# Altium project iMX6 Rex_V1I1.PrjPcb (part 4 of 5)

## Sheet [15] - PWR 3V3, 1V375.SchDoc
size A2; DocumentNumber: 15; SheetNumber: 15; SheetTotal: 20
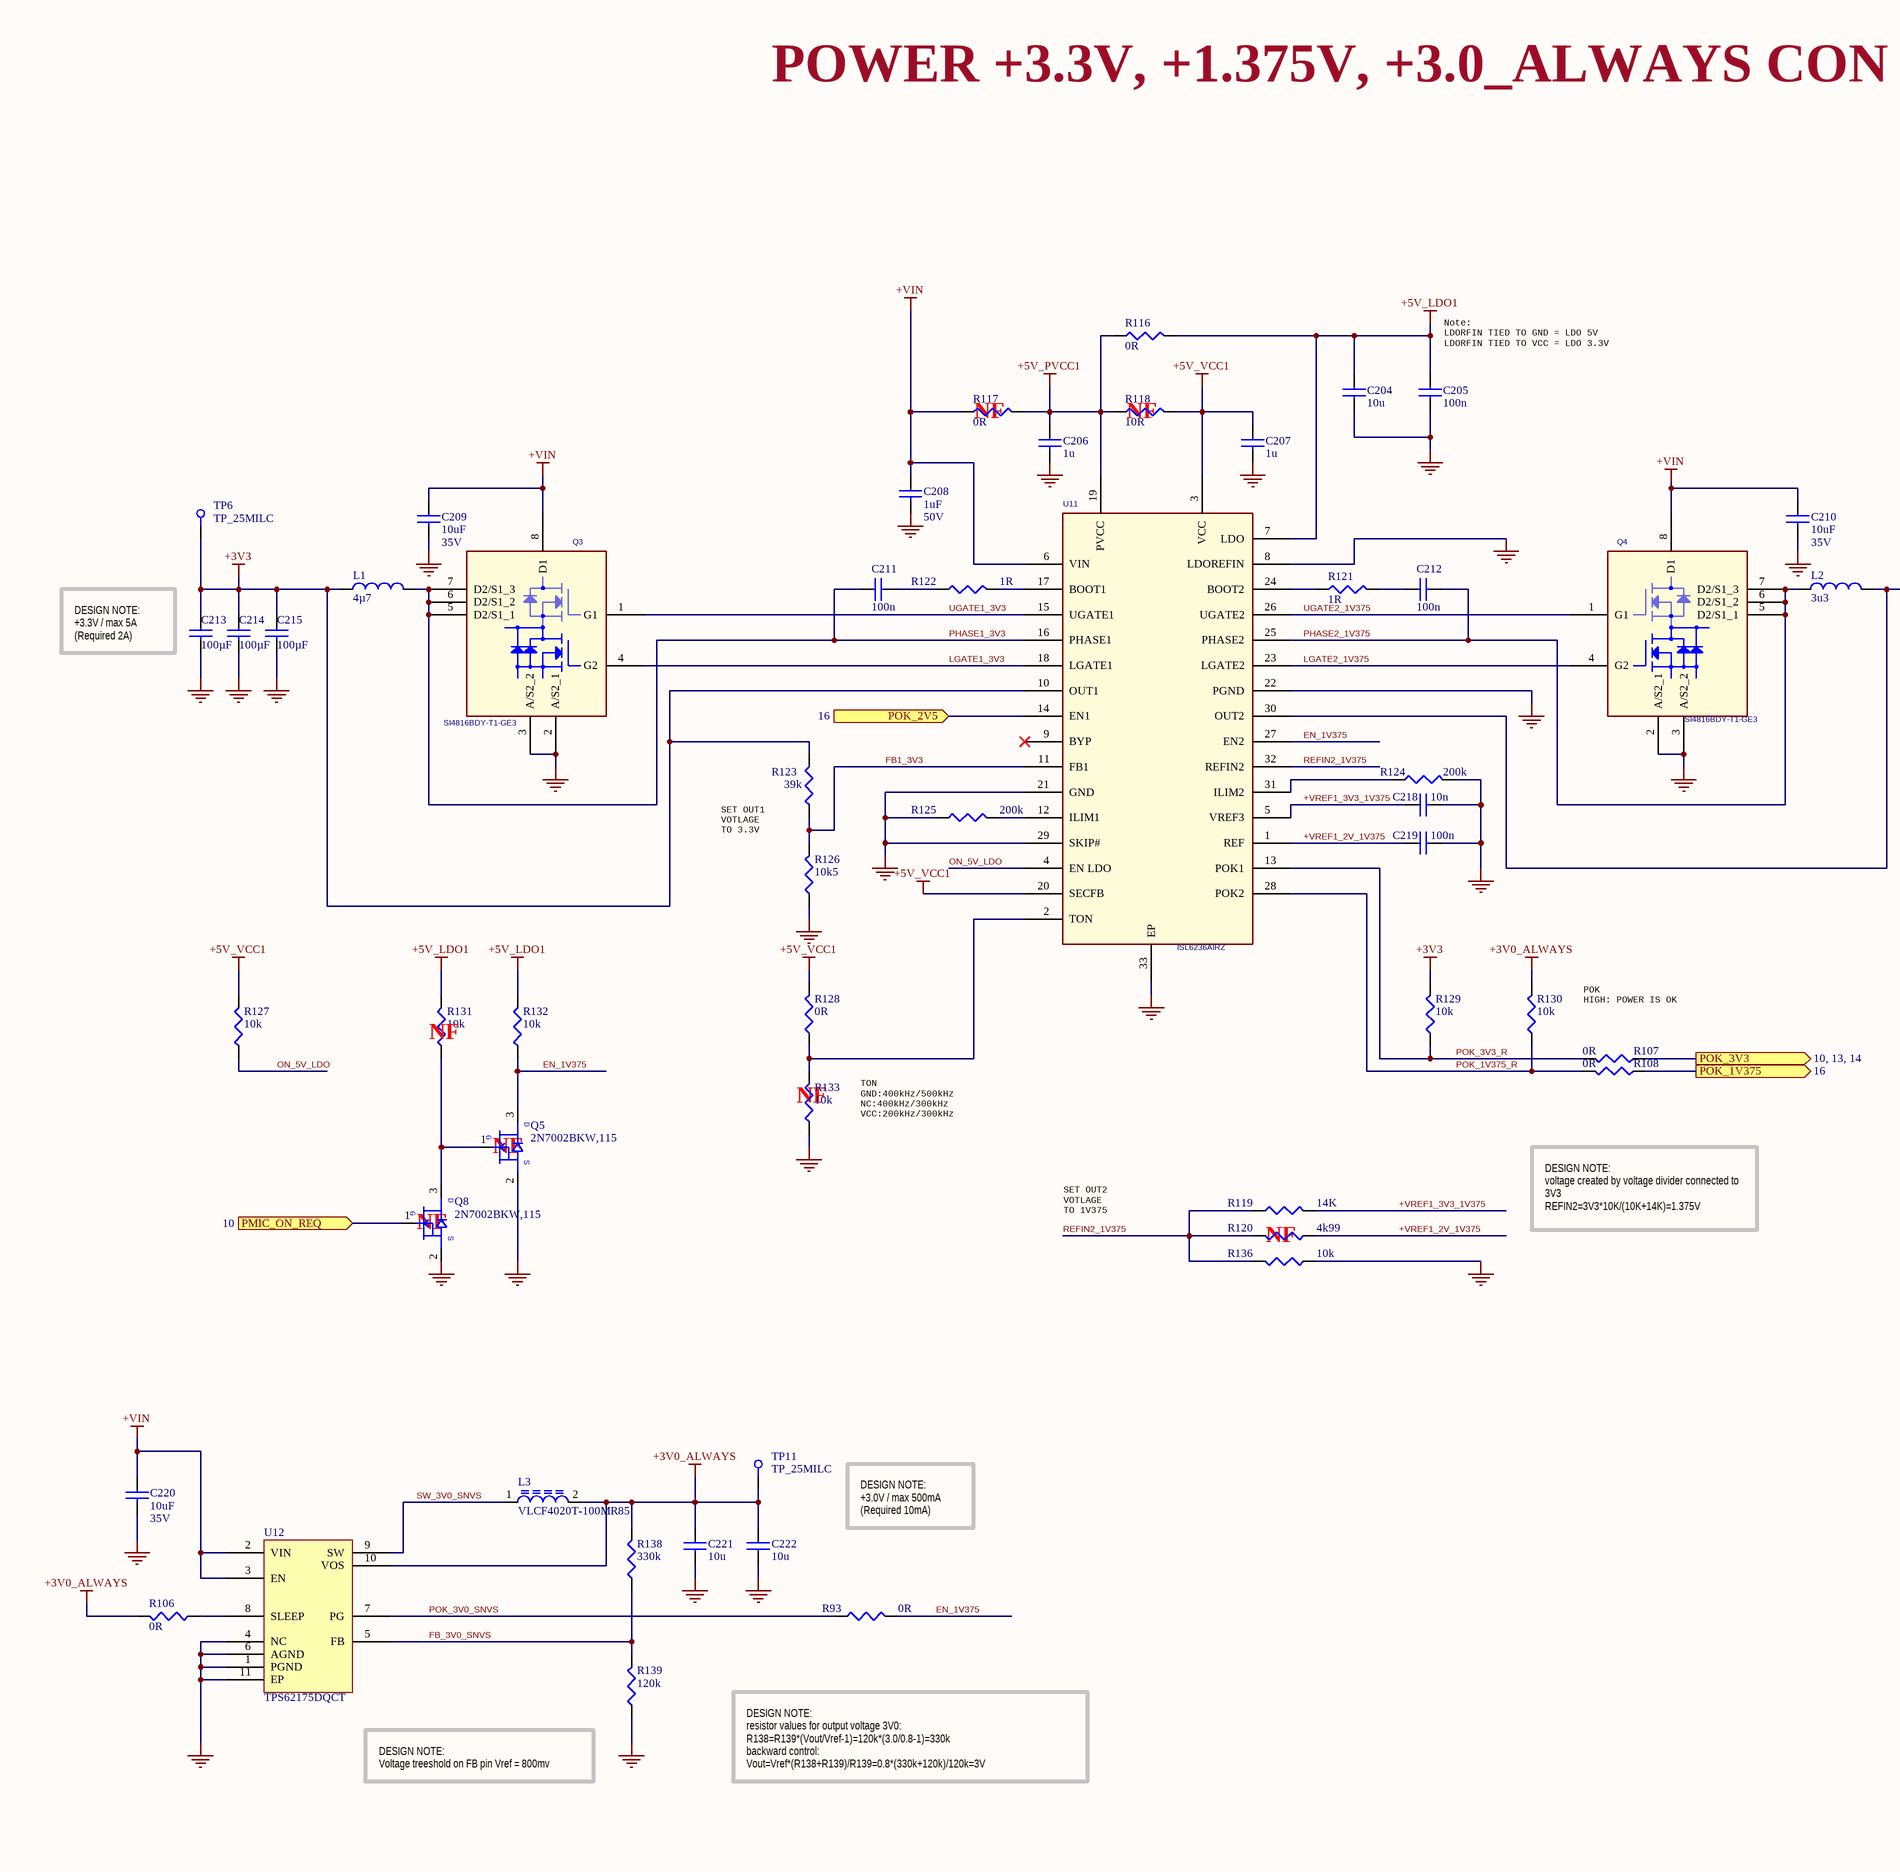
[diagram p16: [15] - PWR 3V3, 1V375.SchDoc, left]
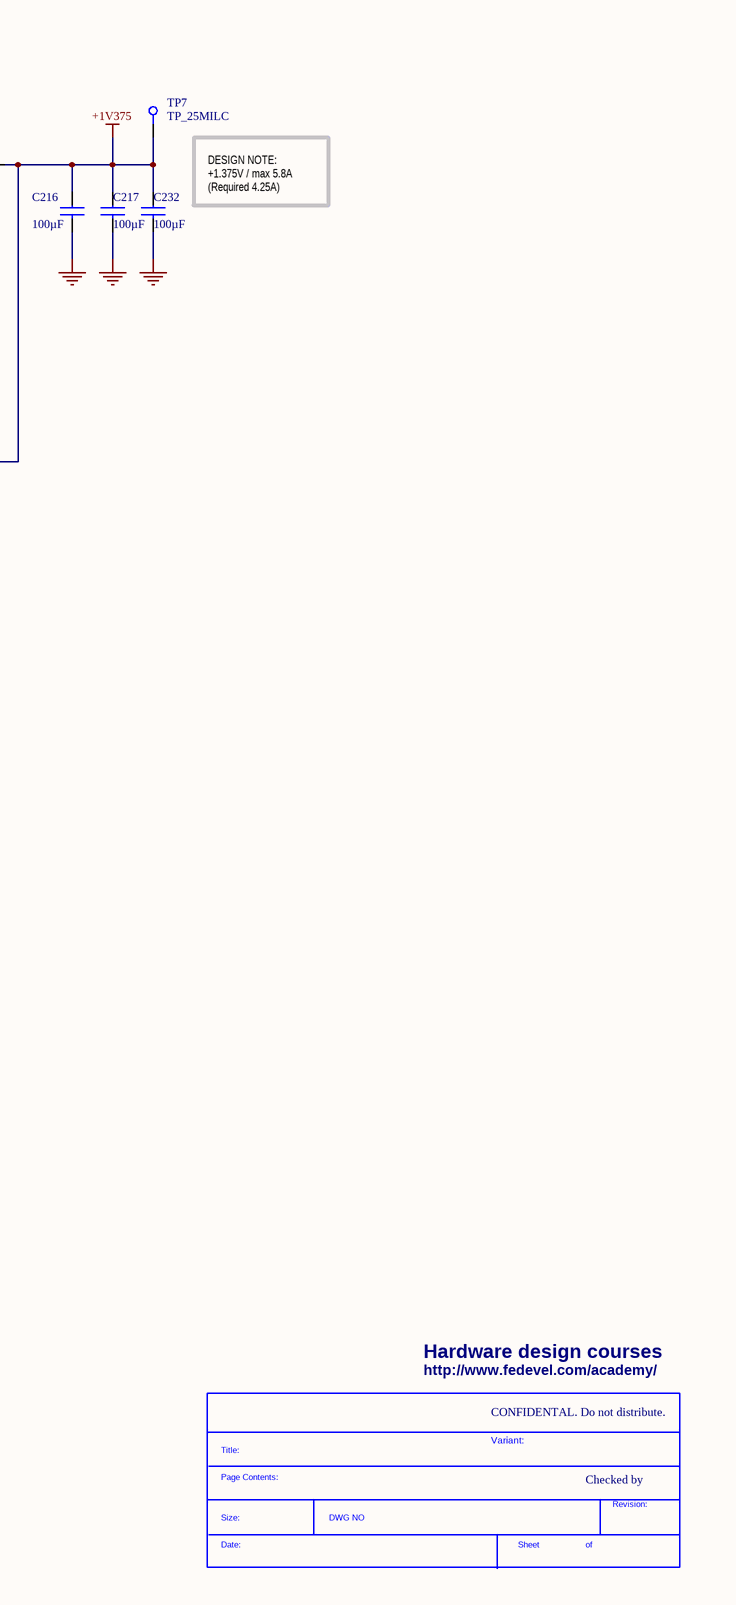
[diagram p17: [15] - PWR 3V3, 1V375.SchDoc, right]

### Parts
(Parts that share a designator on the sheet are numbered #1, #2 ... from top to bottom, then left to right.)
*#10  SDTitleBlock  (value not drawn)  (graphical)
C204  10u  [C0603]
C205  100n  [C0402]
C206  1u  [C0402]
C207  1u  [C0402]
C208  1uF  Voltage - Rated: 50V  [C0805]
C209  10uF  Voltage - Rated: 35V  [C1206]
C210  10uF  Voltage - Rated: 35V  [C1206]
C211  100n  [C0402]
C212  100n  [C0402]
C213  100µF  [C1206]
C214  100µF  [C1206]
C215  100µF  [C1206]
C216  100µF  [C1206]
C217  100µF  [C1206]
C218  10n  [C0402]
C219  100n  [C0402]
C220  10uF  Voltage - Rated: 35V  [C1206]
C221  10u  [C0603]
C222  10u  [C0603]
C232  100µF  [C1206]
L1  4µ7  [IHLP_255MILx270MIL]
L2  3u3  [IHLP_255MILx270MIL]
L3  VLCF4020T-100MR85  [VLCF4020]
Q3  SI4816BDY-T1-GE3  [8_SOIC_3.9MM]
Q4  SI4816BDY-T1-GE3  [8_SOIC_3.9MM]
Q5  2N7002BKW,115  [SC70_SOT323]
Q8  2N7002BKW,115  [SC70_SOT323]
R93  0R  [R0402]
R106  0R  [R0402]
R107  0R  [R0402]
R108  0R  [R0402]
R116  0R  [R0402]
R117  0R  [R0402]
R118  10R  [R0402]
R119  14K  [R0402]
R120  4k99  [R0402]
R121  1R  [R0402]
R122  1R  [R0402]
R123  39k  [R0402]
R124  200k  [R0402]
R125  200k  [R0402]
R126  10k5  [R0402]
R127  10k  [R0402]
R128  0R  [R0402]
R129  10k  [R0402]
R130  10k  [R0402]
R131  10k  [R0402]
R132  10k  [R0402]
R133  10k  [R0402]
R136  10k  [R0402]
R138  330k  [R0402]
R139  120k  [R0402]
TP6  TP_25MILC  [TP_25C]  (no BOM)
TP7  TP_25MILC  [TP_25C]  (no BOM)
TP11  TP_25MILC  [TP_25C]  (no BOM)
U11  ISL6236AIRZ  [32_VFQFN_EXPOSED_PAD]
U12  TPS62175DQCT  [DQC_PWSON-N10]

### Ports
PMIC_ON_REQ (in, see 10), POK_1V375 (out, see 16), POK_2V5 (in, see 16), POK_3V3 (see 10, 13, 14)

### Nets
+1V375: C216.1 C217.1 C232.1 L2.2 TP7.1 U11.30(OUT2)
+3V0_ALWAYS: C221.1 C222.1 L3.2 R106.2 R130.2 R138.2 TP11.1 U12.10(VOS)
+3V3: C213.1 C214.1 C215.1 L1.1 R123.2 R129.2 TP6.1 U11.10(OUT1)
+5V_LDO1: C204.1 C205.1 R116.2 R131.2 R132.2 U11.7(LDO)
+5V_PVCC1: C206.1 R116.1 R117.2 R118.1 U11.19(PVCC)
+5V_VCC1: C207.1 R118.2 R127.2 R128.2 U11.3(VCC) U11.20(SECFB)
+VIN: C208.1 C209.1 C210.1 C220.1 Q3.8(D1) Q4.8(D1) R117.1 U11.6(VIN) U12.2(VIN) U12.3(EN)
GND: C204.2 C205.2 C206.2 C207.2 C208.2 C209.2 C210.2 C213.2 C214.2 C215.2 C216.2 C217.2 C218.2 C219.2 C220.2 C221.2 C222.2 C232.2 Q3.2(A/S2_1) Q3.3(A/S2_2) Q4.2(A/S2_1) Q4.3(A/S2_2) Q5.2(SOURCE) Q8.2(SOURCE) R124.2 R125.1 R126.1 R133.1 R136.1 R139.1 U11.8(LDOREFIN) U11.21(GND) U11.22(PGND) U11.29(SKIP#) U11.33(EP) U12.1(PGND) U12.4(NC) U12.6(AGND) U12.11(EP)
+VREF1_2V_1V375: C219.1 R120.1 U11.1(REF)
+VREF1_3V3_1V375: C218.1 R119.2 U11.5(VREF3)
EN_1V375: Q5.3(DRAIN) R93.2 R132.1 U11.27(EN2)
FB1_3V3: R123.1 R126.2 U11.11(FB1)
FB_3V0_SNVS: R138.1 R139.2 U12.5(FB)
LGATE1_3V3: Q3.4(G2) U11.18(LGATE1)
LGATE2_1V375: Q4.4(G2) U11.23(LGATE2)
ON_5V_LDO: R127.1 U11.4(EN_LDO)
PHASE1_3V3: C211.1 L1.2 Q3.5(D2/S1_1) Q3.6(D2/S1_2) Q3.7(D2/S1_3) U11.16(PHASE1)
PHASE2_1V375: C212.2 L2.1 Q4.5(D2/S1_1) Q4.6(D2/S1_2) Q4.7(D2/S1_3) U11.25(PHASE2)
PMIC_ON_REQ: Q8.1(GATE) ; port PMIC_ON_REQ
POK_1V375: R108.1 ; port POK_1V375
POK_1V375_R: R108.2 R130.1 U11.28(POK2)
POK_2V5: U11.14(EN1) ; port POK_2V5
POK_3V0_SNVS: R93.1 U12.7(PG)
POK_3V3: R107.1 ; port POK_3V3
POK_3V3_R: R107.2 R129.1 U11.13(POK1)
REFIN2_1V375: R119.1 R120.2 R136.2 U11.32(REFIN2)
SW_3V0_SNVS: L3.1 U12.9(SW)
UGATE1_3V3: Q3.1(G1) U11.15(UGATE1)
UGATE2_1V375: Q4.1(G1) U11.26(UGATE2)
NetC211_2: C211.2 R122.1
NetC212_1: C212.1 R121.2
NetQ5_1: Q5.1(GATE) Q8.3(DRAIN) R131.1
NetR106_1: R106.1 U12.8(SLEEP)
NetR121_1: R121.1 U11.24(BOOT2)
NetR122_2: R122.2 U11.17(BOOT1)
NetR124_1: R124.1 U11.31(ILIM2)
NetR125_2: R125.2 U11.12(ILIM1)
NetR128_1: R128.1 R133.2 U11.2(TON)

Not connected (* = marked no-connect by the designer): U11 9(BYP)*

### Notes on the sheet
- POWER +3.3V, +1.375V, +3.0_ALWAYS CON
- (near C205) Note:
  LDORFIN TIED TO GND = LDO 5V
  LDORFIN TIED TO VCC = LDO 3.3V
- (near R117) NF
- (near R118) NF
- (near C213) DESIGN NOTE:
  +3.3V / max 5A
  (Required 2A)
- DESIGN NOTE:
  +1.375V / max 5.8A
  (Required 4.25A)
- SET OUT1
  VOTLAGE
  TO 3.3V
- POK
  HIGH: POWER IS OK
- (near R131) NF
- (near R133) NF
- TON
  GND:400kHz/500kHz
  NC:400kHz/300kHz
  VCC:200kHz/300kHz
- (near Q5) NF
- (near Q8) NF
- SET OUT2
  VOTLAGE
  TO 1V375
- (near R120) NF
- DESIGN NOTE:
  voltage created by voltage divider connected to 3V3
  REFIN2=3V3*10K/(10K+14K)=1.375V
- DESIGN NOTE:
  +3.0V / max 500mA
  (Required 10mA)
- Hardware design courses
- DESIGN NOTE:
  Voltage treeshold on FB pin Vref = 800mv
- DESIGN NOTE:
  resistor values for output voltage 3V0:
  R138=R139*(Vout/Vref-1)=120k*(3.0/0.8-1)=330k
  backward control:
  Vout=Vref*(R138+R139)/R139=0.8*(330k+120k)/120k=3V
- http://www.fedevel.com/academy/
- CONFIDENTAL. Do not distribute.
- Variant:
- Checked by
- (in symbol 2N7002BKW,115) D; G; S
- (in symbol SDTitleBlock) Title:; Page Contents:; Revision:; Size:; DWG NO; Date:; Sheet; of

### Library data of the parts
C204 C221 C222 = C1608X5R0J106M: CAP CER 10UF 6.3V X5R 20% 0603; Manufacturer: TDK Corporation; Capacitance: 10µF; Value: 10µF; .Checked PCB: used; Description: CAP CER 10UF 6.3V 20% X5R 0603; Category: Capacitors; Manufacturer Part Number: C1608X5R0J106M; Operating Temperature: -55°C ~ 85°C; Package / Case: 0603 (1608 Metric); Price 1k [$]: 0.08580; .Checked SCH: used; Voltage - Rated: 6.3V; Features: Low ESR; Supplier Part Number: 445-4112-1-ND; Supplier: Digikey; Supplier 1: Digi-Key; Supplier Part Number 1: 445-4112-1-ND; RoHS: RoHS Compliant; Stock 1: 48157; Pricing 1: 1=0.46, 10=0.363, 100=0.1898, 250=0.14024, 500=0.1089, 1000=0.0858 (USD); Tolerance: ±20%; Temperature Coefficient: X5R; Mounting Type: Surface Mount, MLCC; Applications: General Purpose; Ratings: -; Size / Dimension: 0.063" L x 0.031" W (1.60mm x 0.80mm); Height - Seated (Max): -; Thickness (Max): 0.037" (0.95mm); Lead Spacing: -; Packaging: Cut Tape (CT); Lead Style: -; ComponentLink1URL: http://www.tdk.com/pdf/general_B11.pdf; ComponentLink1Description: http://www.tdk.com/pdf/general_B11.pdf
C205 C211 C212 C219 = C1005X5R1H104K: CAP CER .10UF 50V X5R 10% 0402; Manufacturer: TDK Corporation; Capacitance: 0.1µF; Value: 100nF; .Checked PCB: used; Description: CAP CER 0.1UF 50V 10% X5R 0402; Category: Capacitors; Manufacturer Part Number: C1005X5R1H104K; Operating Temperature: -55°C ~ 85°C; Package / Case: 0402 (1005 Metric); Price 1k [$]: 0.02340; .Checked SCH: used; Voltage - Rated: 50V; Supplier Part Number: 445-5942-1-ND; Supplier: Digikey; Supplier 1: Digi-Key; Supplier Part Number 1: 445-5942-1-ND; RoHS: RoHS Compliant; Stock 1: 106926; Pricing 1: 1=0.27, 10=0.18, 100=0.072, 250=0.05176, 500=0.0369, 1000=0.027 (USD); Tolerance: ±10%; Temperature Coefficient: X5R; Mounting Type: Surface Mount, MLCC; Applications: General Purpose; Ratings: -; Size / Dimension: 0.039" L x 0.020" W (1.00mm x 0.50mm); Height - Seated (Max): -; Thickness (Max): 0.022" (0.55mm); Lead Spacing: -; Features: -; Packaging: Cut Tape (CT); Lead Style: -; ComponentLink1URL: http://www.tdk.co.jp/tefe02/e412_c.pdf; ComponentLink1Description: http://www.tdk.co.jp/tefe02/e412_c.pdf
C206 C207 = C1005X5R1C105K: CAP CER 1.0UF 16V X5R 0402; Manufacturer: TDK Corporation; Capacitance: 1.0µF; Value: 1uF; .Checked PCB: used; Description: CAP CER 1UF 16V 10% X5R 0402; Tolerance: ±10%; Category: Capacitors; Manufacturer Part Number: C1005X5R1C105K; Operating Temperature: -55°C ~ 85°C; Package / Case: 0402 (1005 Metric); Price 1k [$]: 0.02080; .Checked SCH: used; Voltage - Rated: 16V; Supplier Part Number: 445-4978-1-ND; Supplier: Digikey; Supplier 1: Digi-Key; Supplier Part Number 1: 445-4978-1-ND; RoHS: RoHS Compliant; Stock 1: 341010; Pricing 1: 1=0.24, 10=0.16, 100=0.064, 250=0.046, 500=0.0328, 1000=0.024 (USD); Temperature Coefficient: X5R; Mounting Type: Surface Mount, MLCC; Applications: General Purpose; Ratings: -; Size / Dimension: 0.039" L x 0.020" W (1.00mm x 0.50mm); Height - Seated (Max): -; Thickness (Max): 0.022" (0.55mm); Lead Spacing: -; Features: -; Packaging: Cut Tape (CT); Lead Style: -; ComponentLink1URL: http://www.tdk.co.jp/tefe02/e412_c.pdf; ComponentLink1Description: http://www.tdk.co.jp/tefe02/e412_c.pdf
C208 = GRM21BR71H105KA12L: CAP CER 1UF 50V X7R 0805; Manufacturer: Murata Electronics North America; Capacitance: 1.0µF; .Checked PCB: used; Description: CAP CER 1UF 50V 10% X7R 0805; Tolerance: ±10%; Category: Capacitors; Manufacturer Part Number: GRM21BR71H105KA12L; Operating Temperature: -55°C ~ 125°C; Package / Case: 0805 (2012 Metric); Price 1k [$]: 0.1359; Value: 1uF; .Checked SCH: used; Supplier Part Number: 490-4736-1-ND; Supplier: Digikey; Supplier 1: Digi-Key; Supplier Part Number 1: 490-4736-1-ND; RoHS: RoHS Compliant; Stock 1: 422791; Pricing 1: 1=0.28, 10=0.254, 25=0.226, 50=0.1978, 100=0.1836, 250=0.16952, 500=0.16102, 750=0.14691, 1000=0.12995 (USD); Temperature Coefficient: X7R; Mounting Type: Surface Mount, MLCC; Applications: General Purpose; Ratings: -; Size / Dimension: 0.079" L x 0.049" W (2.00mm x 1.25mm); Height - Seated (Max): -; Thickness (Max): 0.053" (1.35mm); Lead Spacing: -; Features: -; Packaging: Cut Tape (CT); Lead Style: -; ComponentLink1URL: http://search.murata.co.jp/Ceramy/image/img/PDF/ENG/GRM21BR71H105KA12.pdf; ComponentLink1Description: http://search.murata.co.jp/Ceramy/image/img/PDF/ENG/GRM21BR71H105KA12.pdf
C209 C210 C220 = GRM31CR6YA106KA12L: CAP CER 10UF 35V X5R 1206; Manufacturer: Murata Electronics North America; Capacitance: 10µF; .Checked PCB: used; Description: CAP CER 10UF 35V 10% X5R 1206; Tolerance: ±10%; Category: Capacitors; Manufacturer Part Number: GRM31CR6YA106KA12L; Operating Temperature: -55°C ~ 85°C; Package / Case: 1206 (3216 Metric); Price 1k [$]: 0.19448; Value: 10uF; .Checked SCH: used; Supplier Part Number: 490-5524-1-ND; Supplier: Digikey; Supplier 1: Digi-Key; Supplier Part Number 1: 490-5524-1-ND; RoHS: RoHS Compliant; Stock 1: 76334; Pricing 1: 1=0.6, 10=0.501, 50=0.359, 100=0.3142, 250=0.24684, 500=0.2244, 1000=0.17952 (USD); Temperature Coefficient: X5R; Mounting Type: Surface Mount, MLCC; Applications: General Purpose; Ratings: -; Size / Dimension: 0.126" L x 0.063" W (3.20mm x 1.60mm); Height - Seated (Max): -; Thickness (Max): 0.071" (1.80mm); Lead Spacing: -; Features: -; Packaging: Cut Tape (CT); Lead Style: -; ComponentLink1URL: http://www.murata.com/products/catalog/pdf/c02e.pdf; ComponentLink1Description: http://www.murata.com/products/catalog/pdf/c02e.pdf
C213-C217 C232 = C3216X5R1A107M: CAP CER 100UF 10V X5R 20% 1206; Manufacturer: TDK Corporation; .Checked PCB: used; Description: CAP CER 100UF 10V 20% X5R 1206; Capacitance: 100µF; Category: Capacitors; Manufacturer Part Number: C3216X5R1A107M; Operating Temperature: -55°C ~ 85°C; Package / Case: 1206 (3216 Metric); Price 1k [$]: 0.85800; Value: 100µF; .Checked SCH: used; Voltage - Rated: 10V; Supplier Part Number: 445-6007-1-ND; Supplier: Digikey; Supplier 1: Digi-Key; Supplier Part Number 1: 445-6007-1-ND; RoHS: RoHS Compliant; Stock 1: 28026; Pricing 1: 1=1.65, 10=1.353, 100=1.089, 250=0.957, 500=0.891, 1000=0.693 (USD); Tolerance: ±20%; Temperature Coefficient: X5R; Mounting Type: Surface Mount, MLCC; Applications: General Purpose; Ratings: -; Size / Dimension: 0.126" L x 0.063" W (3.20mm x 1.60mm); Height - Seated (Max): -; Thickness (Max): 0.071" (1.80mm); Lead Spacing: -; Features: -; Packaging: Cut Tape (CT); Lead Style: -; ComponentLink1URL: http://www.tdk.com/pdf/general_B11.pdf; ComponentLink1Description: http://www.tdk.com/pdf/general_B11.pdf
C218 = C1005X7R1C103K: CAP CER 10000PF 16V X7R 10% 0402; Manufacturer: TDK Corporation; Value: 10nF; .Checked PCB: used; Description: CAP CER 10000PF 16V 10% X7R 0402; Capacitance: 10000pF; Category: Capacitors; Manufacturer Part Number: C1005X7R1C103K; Operating Temperature: -55°C ~ 125°C; Package / Case: 0402 (1005 Metric); Price 1k [$]: 0.00416; .Checked SCH: used; Voltage - Rated: 16V; Supplier Part Number: 445-1262-1-ND; Supplier: Digikey; Supplier 1: Digi-Key; Supplier Part Number 1: 445-1262-1-ND; RoHS: RoHS Compliant; Stock 1: 511497; Pricing 1: 1=0.08, 10=0.05, 100=0.018, 250=0.013, 500=0.0096, 1000=0.0065 (USD); Tolerance: ±10%; Temperature Coefficient: X7R; Mounting Type: Surface Mount, MLCC; Applications: General Purpose; Ratings: -; Size / Dimension: 0.039" L x 0.020" W (1.00mm x 0.50mm); Height - Seated (Max): -; Thickness (Max): 0.022" (0.55mm); Lead Spacing: -; Features: -; Packaging: Cut Tape (CT); Lead Style: -; ComponentLink1URL: http://www.tdk.co.jp/tefe02/e412_c.pdf; ComponentLink1Description: http://www.tdk.co.jp/tefe02/e412_c.pdf
L1 = IHLP2525CZER4R7M01: INDUCTOR POWER 4.7UH 5.5A SMD; Manufacturer: Vishay/Dale; .Checked PCB: used; Inductance: 4.7µH; Current - Saturation: 10A; Shielding: Shielded; DC Resistance (DCR): 40 mOhm Max; Tolerance: ±20%; Frequency - Test: 100kHz; .Checked SCH: used; Category: Inductors, Coils, Chokes; Manufacturer Part Number: IHLP2525CZER4R7M01; Operating Temperature: -55°C ~ 125°C; Package / Case: 0.270" L x 0.255" W x 0.118" H (6.86mm x 6.47mm x 3.00mm); Price 1k [$]: 1.09800; Value: 4µ7; Current: 5.5A; Applications: General Purpose; Supplier Part Number: 541-1010-1-ND; Supplier: Digikey; Supplier 1: Digi-Key; Supplier Part Number 1: 541-1010-1-ND; RoHS: RoHS Compliant; Stock 1: 25684; Pricing 1: 1=2.26, 10=1.83, 100=1.525, 500=1.22, 1000=1.098 (USD); Current - Temperature Rise: 5.5A; Type: -; Q @ Freq: -; Frequency - Self Resonant: -; Material - Core: -; Mounting Type: Surface Mount; Packaging: Cut Tape (CT); ComponentLink1URL: http://www.vishay.com/doc?34104; ComponentLink1Description: http://www.vishay.com/doc?34104
L2 = IHLP2525CZER3R3M01: INDUCTOR POWER 3.3UH 6A SMD; Manufacturer: Vishay Dale; Inductance: 3.3µH; Current - Saturation: 13.5A; Tolerance: ±20%; Shielding: Shielded; DC Resistance (DCR): 30 mOhm Max; Frequency - Test: 100kHz; .Checked PCB: RF; Supplier 1: Digi-Key; Supplier Part Number 1: 541-1009-1-ND; Manufacturer Part Number: IHLP2525CZER3R3M01; RoHS: RoHS Compliant; Category: Inductors, Coils, Chokes; Stock 1: 20795; Pricing 1: 1=2.26, 10=1.83, 100=1.525, 500=1.22, 1000=1.098 (USD); Current: 6A; Current - Temperature Rise: 6A; Type: -; Q @ Freq: -; Frequency - Self Resonant: -; Applications: General Purpose; Material - Core: -; Package / Case: 0.270" L x 0.255" W x 0.118" H (6.86mm x 6.47mm x 3.00mm); Mounting Type: Surface Mount; Packaging: Cut Tape (CT); Operating Temperature: -55°C ~ 125°C; ComponentLink1URL: http://www.vishay.com/doc?34104; ComponentLink1Description: http://www.vishay.com/doc?34104; .Checked SCH: RF
L3 = VLCF4020T-100MR85: INDUCTOR POWER 10UH .85A SMD; Manufacturer: TDK Corporation; Inductance: 10µH; Current Rating: 850mA; Tolerance: ±20%; Shielding: Shielded; DC Resistance (DCR): 185 mOhm Max; Frequency - Test: 100kHz; .Creator: MM; .Checked PCB: MM, checked by RF; Supplier 1: Digi-Key; Manufacturer Part Number: VLCF4020T-100MR85; RoHS: RoHS Compliant; Category: Inductors, Coils, Chokes; Stock 1: 53975; Pricing 1: 1=0.77, 10=0.68, 50=0.5526, 100=0.51, 500=0.442 (USD); Type: -; Current - Saturation: 850mA; Material - Core: -; Q @ Freq: -; Frequency - Self Resonant: -; Operating Temperature: -40°C ~ 105°C; Package / Case: Non Standard; Size / Dimension: 0.157" L x 0.157" W x 0.079" H (4.00mm x 4.00mm x 2.00mm); Mounting Type: Surface Mount; Packaging: Cut Tape (CT); ComponentLink1URL: http://www.tdk.co.jp/tefe02/e531_vlcf.pdf; ComponentLink1Description: http://www.tdk.co.jp/tefe02/e531_vlcf.pdf; Supplier Part Number 1: 445-3186-1-ND; .Checked SCH: MM, checked by RF
Q3 Q4 = SI4816BDY-T1-GE3: MOSFET DL N-CH 30V 6.8A 8-SOIC; Manufacturer: Vishay/Siliconix; .Checked PCB: used; FET Type: 2 N-Channel (Dual); FET Feature: Logic Level Gate; Rds On (Max) @ Id, Vgs: 18.5 mOhm @ 6.8A, 10V; Current - Continuous Drain (Id) @ 25° C: 5.8A, 8.2A; Vgs(th) (Max) @ Id: 3V @ 250µA; Power - Max: 1W, 1.25W; Gate Charge (Qg) @ Vgs: 10nC @ 5V; .Checked SCH: used; Category: Discrete Semiconductor Products; Manufacturer Part Number: SI4816BDY-T1-GE3; Package / Case: 8-SOIC (0.154", 3.90mm Width); Price 1k [$]: 0.84800; Value: SI4816BDY-T1-GE3; Family: FETs - Arrays; Drain to Source Voltage (Vdss): 30V; Supplier Part Number: SI4816BDY-T1-GE3CT-ND; Supplier: Digikey; Supplier 1: Digi-Key; Supplier Part Number 1: SI4816BDY-T1-GE3CT-ND; RoHS: RoHS Compliant; Stock 1: 15735; Pricing 1: 1=1.84, 25=1.4228, 100=1.2912, 250=1.1594, 500=1.0013, 1000=0.8432 (USD); Input Capacitance (Ciss) @ Vds: -; Mounting Type: Surface Mount; Supplier Device Package: 8-SOICN; Packaging: Cut Tape (CT); ComponentLink1URL: http://www.vishay.com/docs/73026/si4816bd.pdf; ComponentLink1Description: http://www.vishay.com/docs/73026/si4816bd.pdf
Q5 Q8 = 2N7002BKW,115: MOSFET N-CH 60V 310MA SOT323; Manufacturer: NXP Semiconductors; FET Type: MOSFET N-Channel, Metal Oxide; FET Feature: Logic Level Gate; Rds On (Max) @ Id, Vgs: 1.6 Ohm @ 500mA, 10V; Vgs(th) (Max) @ Id: 2.1V @ 250µA; Gate Charge (Qg) @ Vgs: 0.6nC @ 4.5V; Input Capacitance (Ciss) @ Vds: 50pF @ 10V; Power - Max: 275mW; .Checked PCB: RF; Supplier 1: Digi-Key; Supplier Part Number 1: 568-5980-1-ND; Manufacturer Part Number: 2N7002BKW,115; RoHS: RoHS Compliant; Category: Discrete Semiconductor Products; Stock 1: 15666; Pricing 1: 1=0.39, 10=0.354, 25=0.2548, 100=0.1983, 250=0.12456, 500=0.10616, 1000=0.07233 (USD); Drain to Source Voltage (Vdss): 60V; Current - Continuous Drain (Id) @ 25° C: 310mA; Mounting Type: Surface Mount; Package / Case: SC-70, SOT-323; Supplier Device Package: SC-70; Packaging: Cut Tape (CT); ComponentLink1URL: http://www.nxp.com/documents/data_sheet/2N7002BKW.pdf; ComponentLink1Description: http://www.nxp.com/documents/data_sheet/2N7002BKW.pdf; .Checked SCH: RF
R93 R106-R108 R116 R117 R128 = RC0402JR-070RL: RES 0.0 OHM 1/16W 0402 SMD; Manufacturer: Yageo; Resistance (Ohms): 0.0; Power (Watts): 0.063W, 1/16W; Tolerance: Jumper; .Checked PCB: used; Category: Resistors; Supplier Part Number: 311-0.0JRCT-ND; Manufacturer Part Number: RC0402JR-070RL; Package / Case: 0402 (1005 Metric); Price 1k [$]: 0.01389; Value: 0R; .Checked SCH: used; Supplier: Digikey; Supplier 1: Digi-Key; Supplier Part Number 1: 311-0.0JRCT-ND; RoHS: RoHS Compliant; Stock 1: 1106330; Pricing 1: 10=0.012, 50=0.009, 100=0.0069, 250=0.00512, 500=0.0038, 1000=0.00253 (USD); Composition: Thick Film; Features: -; Temperature Coefficient: -; Size / Dimension: 0.039" L x 0.020" W (1.00mm x 0.50mm); Height: 0.016" (0.40mm); Number of Terminations: 2; Packaging: Cut Tape (CT); ComponentLink1URL: http://www.yageo.com/documents/recent/PYu-RC0402_51_RoHS_L_6.pdf; ComponentLink1Description: http://www.yageo.com/documents/recent/PYu-RC0402_51_RoHS_L_6.pdf
R118 = RC0402FR-0710RL: RES 10.0 OHM 1/16W 1% 0402 SMD; Manufacturer: Yageo; Resistance (Ohms): 10; Power (Watts): 0.063W, 1/16W; .Checked PCB: used; Temperature Coefficient: ±200ppm/°C; Category: Resistors; Manufacturer Part Number: RC0402FR-0710RL; Package / Case: 0402 (1005 Metric); Price 1k [$]: 0.01421; Tolerance: ±1%; Value: 10R; .Checked SCH: used; Supplier Part Number: 311-10.0LRCT-ND; Supplier: Digikey; Supplier 1: Digi-Key; Supplier Part Number 1: 311-10.0LRCT-ND; RoHS: RoHS Compliant; Stock 1: 681416; Pricing 1: 10=0.014, 50=0.0104, 100=0.0079, 250=0.00584, 500=0.00432, 1000=0.00288 (USD); Composition: Thick Film; Features: -; Size / Dimension: 0.039" L x 0.020" W (1.00mm x 0.50mm); Height: 0.016" (0.40mm); Number of Terminations: 2; Packaging: Cut Tape (CT); ComponentLink1URL: http://www.yageo.com/documents/recent/PYu-RC0402_51_RoHS_L_6.pdf; ComponentLink1Description: http://www.yageo.com/documents/recent/PYu-RC0402_51_RoHS_L_6.pdf
R119 = RC0402FR-0714KL: RES 14.0K OHM 1/16W 1% 0402 SMD; Manufacturer: Yageo; Power (Watts): 0.063W, 1/16W; Temperature Coefficient: ±100ppm/°C; .Checked PCB: RF, used by MM; .Checked SCH: MM, checked by RF; .Creator: MM; Supplier 1: Digi-Key; Manufacturer Part Number: RC0402FR-0714KL; RoHS: RoHS Compliant; Category: Resistors; Stock 1: 74440; Pricing 1: 1=0.1, 10=0.014, 25=0.0104, 100=0.0063, 250=0.0054, 500=0.00382, 1000=0.0027, 2500=0.00234, 5000=0.00203 (USD); Packaging: Cut Tape (CT); Resistance (Ohms): 14k; Composition: Thick Film; Features: -; Tolerance: ±1%; Package / Case: 0402 (1005 Metric); Supplier Device Package: 0402; Size / Dimension: 0.039" L x 0.020" W (1.00mm x 0.50mm); Height: 0.016" (0.40mm); Number of Terminations: 2; ComponentLink1URL: http://www.yageo.com/documents/recent/PYu-RC0402_51_RoHS_L_6.pdf; ComponentLink1Description: http://www.yageo.com/documents/recent/PYu-RC0402_51_RoHS_L_6.pdf; Supplier Part Number 1: 311-14.0KLRCT-ND; Creator: MM
R120 = RMCF0402FT4K99: RES TF 4.99K OHM 1% 1/16W 0402; Manufacturer: Stackpole Electronics Inc; Power (Watts): 0.063W, 1/16W; .Checked PCB: used; Temperature Coefficient: ±100ppm/°C; Category: Resistors; Supplier Part Number: RMCF0402FT4K99CT-ND; Manufacturer Part Number: RMCF0402FT4K99; Package / Case: 0402 (1005 Metric); Price 1k [$]: 0.00384; Resistance (Ohms): 4.99K; Tolerance: ±1%; Value: 4k99; .Checked SCH: used; Supplier: Digikey; Supplier 1: Digi-Key; Supplier Part Number 1: RMCF0402FT4K99CT-ND; RoHS: RoHS Compliant; Stock 1: 48509; Pricing 1: 1=0.04, 10=0.025, 50=0.0138, 100=0.0105, 250=0.0078, 500=0.00576, 1000=0.00384 (USD); Composition: Thick Film; Features: -; Size / Dimension: 0.039" L x 0.020" W (1.00mm x 0.50mm); Height: 0.016" (0.40mm); Number of Terminations: 2; Packaging: Cut Tape (CT); ComponentLink1URL: http://www.seielect.com/Catalog/SEI-RMCF.pdf; ComponentLink1Description: http://www.seielect.com/Catalog/SEI-RMCF.pdf
R121 R122 = RC0402FR-071RL: RES 1.00 OHM 1/16W 1% 0402 SM; Manufacturer: Yageo; Resistance (Ohms): 1; Power (Watts): 0.063W, 1/16W; .Checked PCB: used; Description: RES 1.00 OHM 1/16W 1% 0402 SMD; Temperature Coefficient: ±200ppm/°C; Category: Resistors; Manufacturer Part Number: RC0402FR-071RL; Package / Case: 0402 (1005 Metric); Price 1k [$]: 0.01421; Tolerance: ±1%; Value: 1R; .Checked SCH: used; Supplier Part Number: 311-1.00LRCT-ND; Supplier: Digikey; Supplier 1: Digi-Key; Supplier Part Number 1: 311-1.00LRCT-ND; RoHS: RoHS Compliant; Stock 1: 347765; Pricing 1: 10=0.019, 50=0.0142, 100=0.0109, 250=0.00808, 500=0.00596, 1000=0.00397 (USD); Composition: Thick Film; Features: -; Size / Dimension: 0.039" L x 0.020" W (1.00mm x 0.50mm); Height: 0.016" (0.40mm); Number of Terminations: 2; Packaging: Cut Tape (CT); ComponentLink1URL: http://www.yageo.com/documents/recent/PYu-RC0402_51_RoHS_L_6.pdf; ComponentLink1Description: http://www.yageo.com/documents/recent/PYu-RC0402_51_RoHS_L_6.pdf
R123 = RC0402FR-0739KL: RES 39.0K OHM 1/16W 1% 0402 SMD; Manufacturer: Yageo; Power (Watts): 0.063W, 1/16W; .Checked PCB: used; Temperature Coefficient: ±100ppm/°C; Category: Resistors; Manufacturer Part Number: RC0402FR-0739KL; Package / Case: 0402 (1005 Metric); Price 1k [$]: 0.01421; Resistance (Ohms): 39K; Tolerance: ±1%; Value: 39k; .Checked SCH: used; Supplier Part Number: 311-39.0KLRCT-ND; Supplier: Digikey; Supplier 1: Digi-Key; Supplier Part Number 1: 311-39.0KLRCT-ND; RoHS: RoHS Compliant; Stock 1: 36775; Pricing 1: 10=0.014, 50=0.0104, 100=0.0079, 250=0.00584, 500=0.00432, 1000=0.00288 (USD); Composition: Thick Film; Features: -; Size / Dimension: 0.039" L x 0.020" W (1.00mm x 0.50mm); Height: 0.016" (0.40mm); Number of Terminations: 2; Packaging: Cut Tape (CT); ComponentLink1URL: http://www.yageo.com/documents/recent/PYu-RC0402_51_RoHS_L_6.pdf; ComponentLink1Description: http://www.yageo.com/documents/recent/PYu-RC0402_51_RoHS_L_6.pdf
R124 R125 = RC0402FR-07200KL: RES 200K OHM 1/16W 1% 0402 SMD; Manufacturer: Yageo; Power (Watts): 0.063W, 1/16W; .Checked PCB: used; Temperature Coefficient: ±100ppm/°C; Category: Resistors; Manufacturer Part Number: RC0402FR-07200KL; Package / Case: 0402 (1005 Metric); Price 1k [$]: 0.01421; Resistance (Ohms): 200K; Tolerance: ±1%; Value: 200k; .Checked SCH: used; Supplier Part Number: 311-200KLRCT-ND; Supplier: Digikey; Supplier 1: Digi-Key; Supplier Part Number 1: 311-200KLRCT-ND; RoHS: RoHS Compliant; Stock 1: 225869; Pricing 1: 10=0.014, 50=0.0104, 100=0.0079, 250=0.00584, 500=0.00432, 1000=0.00288 (USD); Composition: Thick Film; Features: -; Size / Dimension: 0.039" L x 0.020" W (1.00mm x 0.50mm); Height: 0.016" (0.40mm); Number of Terminations: 2; Packaging: Cut Tape (CT); ComponentLink1URL: http://www.yageo.com/documents/recent/PYu-RC0402_51_RoHS_L_6.pdf; ComponentLink1Description: http://www.yageo.com/documents/recent/PYu-RC0402_51_RoHS_L_6.pdf
R126 = CRCW040210K5FKED: RES 10.5K OHM 1/16W 1% 0402 SMD; Manufacturer: Vishay/Dale; Power (Watts): 0.063W, 1/16W; .Checked PCB: used; Temperature Coefficient: ±100ppm/°C; Category: Resistors; Manufacturer Part Number: CRCW040210K5FKED; Package / Case: 0402 (1005 Metric); Price 1k [$]: 0.01740; Resistance (Ohms): 10.5K; Tolerance: ±1%; Value: 10k5; .Checked SCH: used; Supplier Part Number: 541-10.5KLCT-ND; Supplier: Digikey; Supplier 1: Digi-Key; Supplier Part Number 1: 541-10.5KLCT-ND; RoHS: RoHS Compliant; Stock 1: 36157; Pricing 1: 10=0.083, 50=0.0444, 200=0.0255, 1000=0.0174 (USD); Composition: Thick Film; Features: -; Size / Dimension: 0.039" L x 0.020" W (1.00mm x 0.50mm); Height: 0.016" (0.40mm); Number of Terminations: 2; Packaging: Cut Tape (CT); ComponentLink1URL: http://www.vishay.com/doc?20035; ComponentLink1Description: http://www.vishay.com/doc?20035
R127 R129-R133 R136 = RC0402FR-0710KL: RES 10.0K OHM 1/16W 1% 0402 SMD; Manufacturer: Yageo; Power (Watts): 0.063W, 1/16W; .Checked PCB: used; Temperature Coefficient: ±100ppm/°C; Category: Resistors; Manufacturer Part Number: RC0402FR-0710KL; Package / Case: 0402 (1005 Metric); Price 1k [$]: 0.01421; Resistance (Ohms): 10K; Tolerance: ±1%; Value: 10k; .Checked SCH: used; Supplier Part Number: 311-10.0KLRCT-ND; Supplier: Digikey; Supplier 1: Digi-Key; Supplier Part Number 1: 311-10.0KLRCT-ND; RoHS: RoHS Compliant; Stock 1: 2916495; Pricing 1: 10=0.014, 50=0.0104, 100=0.0079, 250=0.00584, 500=0.00432, 1000=0.00288 (USD); Composition: Thick Film; Features: -; Size / Dimension: 0.039" L x 0.020" W (1.00mm x 0.50mm); Height: 0.016" (0.40mm); Number of Terminations: 2; Packaging: Cut Tape (CT); ComponentLink1URL: http://www.yageo.com/documents/recent/PYu-RC0402_51_RoHS_L_6.pdf; ComponentLink1Description: http://www.yageo.com/documents/recent/PYu-RC0402_51_RoHS_L_6.pdf
R138 = CRCW0402330KFKED: RES 330K OHM 1/16W 1% 0402 SMD; Manufacturer: Vishay Dale; Power (Watts): 0.063W, 1/16W; Temperature Coefficient: ±100ppm/°C; .Checked PCB: RF; Supplier 1: Digi-Key; Supplier Part Number 1: 541-330KLCT-ND; Manufacturer Part Number: CRCW0402330KFKED; RoHS: RoHS Compliant; Category: Resistors; Stock 1: 120252; Pricing 1: 10=0.083, 50=0.0444, 200=0.0255, 1000=0.0174 (USD); Resistance (Ohms): 330K; Composition: Thick Film; Features: -; Tolerance: ±1%; Package / Case: 0402 (1005 Metric); Size / Dimension: 0.039" L x 0.020" W (1.00mm x 0.50mm); Height: 0.016" (0.40mm); Number of Terminations: 2; Packaging: Cut Tape (CT); ComponentLink1URL: http://www.vishay.com/doc?20035; ComponentLink1Description: http://www.vishay.com/doc?20035; .Checked SCH: RF
R139 = RC0402FR-07120KL: RES 120K OHM 1/16W 1% 0402 SMD; Manufacturer: Yageo; Power (Watts): 0.063W, 1/16W; .Checked PCB: OK RF; .Checked SCH: RF; Temperature Coefficient: ±100ppm/°C; Category: Resistors; Supplier Part Number: 311-120KLRCT-ND; Manufacturer Part Number: RC0402FR-07120KL; Package / Case: 0402 (1005 Metric); Price 1k [$]: 0.01421; Resistance (Ohms): 120K; Tolerance: ±1%; Value: 120k; Supplier: Digikey; Supplier 1: Digi-Key; Supplier Part Number 1: 311-120KLRCT-ND; RoHS: RoHS Compliant; Stock 1: 213662; Pricing 1: 10=0.014, 50=0.0104, 100=0.0079, 250=0.00584, 500=0.00432, 1000=0.00288 (USD); Composition: Thick Film; Features: -; Size / Dimension: 0.039" L x 0.020" W (1.00mm x 0.50mm); Height: 0.016" (0.40mm); Number of Terminations: 2; Packaging: Cut Tape (CT); ComponentLink1URL: http://www.yageo.com/documents/recent/PYu-RC0402_51_RoHS_L_6.pdf; ComponentLink1Description: http://www.yageo.com/documents/recent/PYu-RC0402_51_RoHS_L_6.pdf
TP6 TP7 TP11 = TP_25MILC: Test Point 25mil
U11 = ISL6236AIRZ: IC MAIN PWR CTRLR QUAD 32-QFN; Manufacturer: Intersil; .Checked PCB: used; Voltage - Input: 4.5 V ~ 25 V; Number of Outputs: 4; Voltage - Output: Multiple; .Checked SCH: used; Category: Integrated Circuits (ICs); Manufacturer Part Number: ISL6236AIRZ; Operating Temperature: -40°C ~ 100°C; Package / Case: 32-VFQFN Exposed Pad; Price 1k [$]: 3.0840; Value: ISL6236AIRZ; Family: PMIC - Voltage Regulators - Special Purpose; Supplier Part Number: ISL6236AIRZ-ND; Supplier: Digikey; Supplier 1: Digi-Key; Supplier Part Number 1: ISL6236AIRZ-ND; RoHS: RoHS Compliant; Stock 1: 0; Pricing 1: 600=4.28 (USD); Applications: Controller, Notebook Power System; Mounting Type: Surface Mount; Supplier Device Package: 32-QFN Exposed Pad (5x5); Packaging: Tube; ComponentLink1URL: http://www.intersil.com/data/fn/fn6453.pdf; ComponentLink1Description: http://www.intersil.com/data/fn/fn6453.pdf
U12 = TPS62175DQCT: IC REG BUCK SYNC ADJ 0.5A 10WSON; Manufacturer: Texas Instruments; Output Type: Adjustable; Number of Outputs: 1; Voltage - Output: 1 V ~ 6 V; Voltage - Input: 4.75 V ~ 28 V; PWM Type: Hybrid; Frequency - Switching: 1MHz; Current - Output: 500mA; Synchronous Rectifier: Yes; .Creator: MM; .Checked PCB: MM, checked by RF; Supplier 1: Digi-Key; Manufacturer Part Number: TPS62175DQCT; RoHS: RoHS Compliant; Category: Integrated Circuits (ICs); Stock 1: 592; Pricing 1: 1=3.13, 10=2.825, 25=2.5308, 100=1.3244 (USD); Type: Step-Down (Buck); Operating Temperature: -40°C ~ 85°C; Mounting Type: Surface Mount; Package / Case: 10-WFDFN Exposed Pad; Packaging: Cut Tape (CT); Supplier Device Package: 10-WSON Exposed Pad (3x2); ComponentLink1URL: http://www.ti.com/lit/ds/symlink/tps62175.pdf; ComponentLink1Description: http://www.ti.com/lit/ds/symlink/tps62175.pdf; Supplier Part Number 1: 296-35096-1-ND; .Checked SCH: MM, checked by RF